# Altium schematic sheet HighSpeedSlots_x2.SchDoc: 2-Channel High-Speed Slots for DA-Card
size A4; DocumentNumber: 7; SheetNumber: 7; SheetTotal: 16
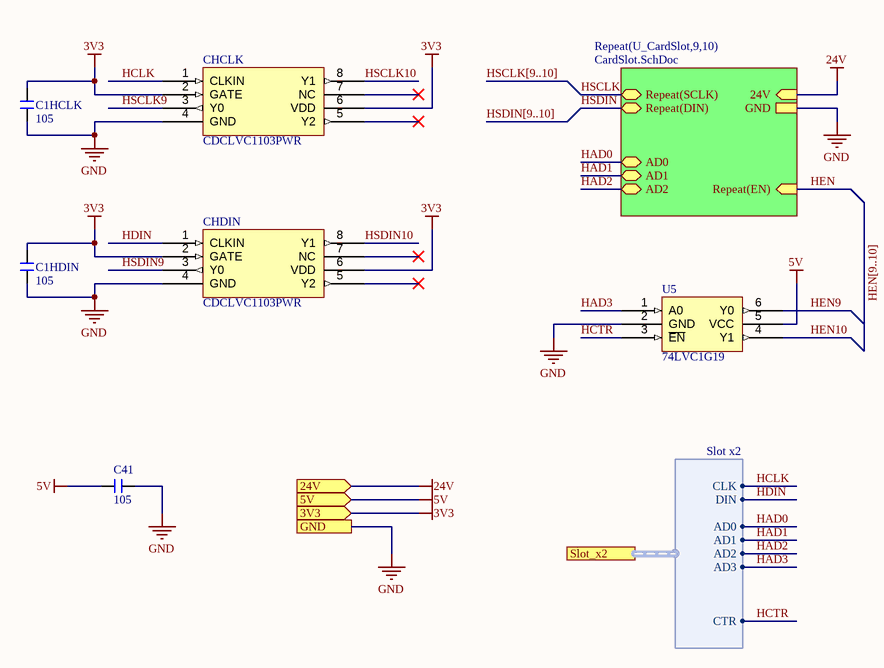
[diagram p0: HighSpeedSlots_x2.SchDoc]

## Parts
C1HCLK  105  [C 0603_L]
C1HDIN  105  [C 0603_L]
C41  105  [C 0603_L]
CHCLK  CDCLVC1103PWR  [TSSOP-8-3mm]
CHDIN  CDCLVC1103PWR  [TSSOP-8-3mm]
U5  74LVC1G19  [SOT23-6]

## Sub-sheets
Repeat(U_CardSlot,9,10) = CardSlot.SchDoc: 24V (in), GND, Repeat(SCLK) (bidir), Repeat(DIN) (bidir), AD0 (bidir), AD1 (bidir), AD2 (bidir), Repeat(EN) (in)

## Ports
3V3 (in), 5V (in), 24V (in), GND, Slot_x2 (harness Slot x2)

## Harnesses
Slot x2: CLK, DIN, AD0, AD1, AD2, AD3, CTR

## Nets
3V3: C1HCLK.2 C1HDIN.2 CHCLK.2(GATE) CHCLK.6(VDD) CHDIN.2(GATE) CHDIN.6(VDD) ; port 3V3
5V: C41.2 U5.5(VCC) ; port 5V
24V: port 24V, sheet Repeat(U_CardSlot,9,10)/24V
GND: C1HCLK.1 C1HDIN.1 C41.1 CHCLK.4(GND) CHDIN.4(GND) U5.2(GND) ; port GND, sheet Repeat(U_CardSlot,9,10)/GND
HAD0: sheet Repeat(U_CardSlot,9,10)/AD0, port Slot_x2.AD0
HAD1: sheet Repeat(U_CardSlot,9,10)/AD1, port Slot_x2.AD1
HAD2: sheet Repeat(U_CardSlot,9,10)/AD2, port Slot_x2.AD2
HAD3: U5.1(A0) ; port Slot_x2.AD3
HCLK: CHCLK.1(CLKIN) ; port Slot_x2.CLK
HCTR: U5.3(~{EN}) ; port Slot_x2.CTR
HDIN: CHDIN.1(CLKIN) ; port Slot_x2.DIN
HEN: sheet Repeat(U_CardSlot,9,10)/Repeat(EN)
HEN9: U5.6(Y0)
HEN10: U5.4(Y1)
HSCLK: sheet Repeat(U_CardSlot,9,10)/Repeat(SCLK)
HSCLK9: CHCLK.3(Y0)
HSCLK10: CHCLK.8(Y1)
HSDIN: sheet Repeat(U_CardSlot,9,10)/Repeat(DIN)
HSDIN9: CHDIN.3(Y0)
HSDIN10: CHDIN.8(Y1)

Not connected (* = marked no-connect by the designer): CHCLK 5(Y2)* 7(NC)*; CHDIN 5(Y2)* 7(NC)*

## Buses and harness runs
bus HEN[9..10]
bus HSCLK[9..10]
bus HSDIN[9..10]

## Notes on the sheet
- Title
- FileName:
- Version:
- Date:
- Project
- Designed By:
- Descriptions:
- Sheet:
- of

## Library data of the parts
C1HCLK C1HDIN C41 = C: 贴片电容; BOM名称: 无极性贴片电容; 淘宝ID: 封装库来自淘宝 ID：黄晶宝石; 联系售后，技术支持: https://shop463601444.taobao.com; 唯一出售店铺网址: https://shop463601444.taobao.com
CHCLK CHDIN = CDCLVC1103PWR: 1:3 Clock Fan-out Buffer
U5 = 74LVC1G19: 1-to-2 Decoder ActiveLow C58923